# Altium schematic sheet BigBed.SchDoc
size A
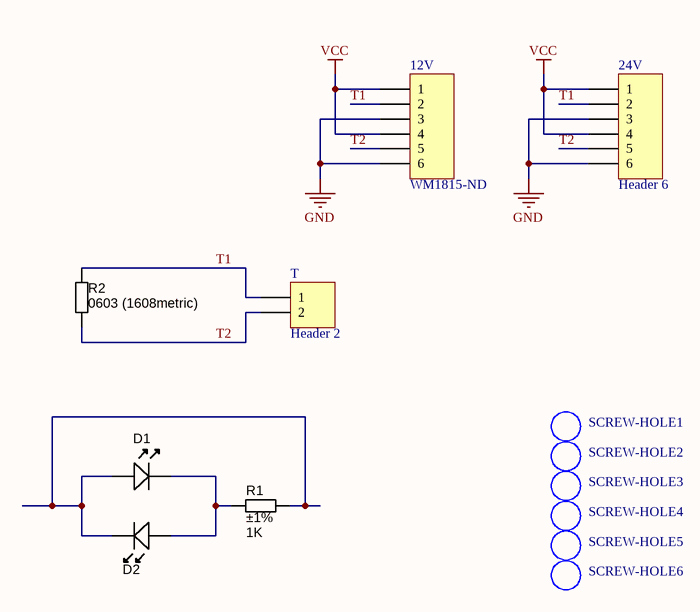
[diagram p0: BigBed.SchDoc]

## Parts
12V  WM1815-ND  [Molex Micro-Fit 6]
24V  Header 6  [Molex Micro-Fit 6]
D1  (no value)  [LED-0805-K]
D2  (no value)  [LED-0805-K]
R1  value 1K  Tolerance: ±1%  [RESC2012X70N]  (hidden comment: Thick Film)
R2  Package / Case: 0603 (1608metric)  [RESC1608X55N]  (hidden comment: RES_EMPTY_0603)
SCREW-HOLE1  Screw Hole  [M3-Hole-2]  (value not drawn)
SCREW-HOLE2  Screw Hole  [M3-Hole-2]  (value not drawn)
SCREW-HOLE3  Screw Hole  [M3-Hole-2]  (value not drawn)
SCREW-HOLE4  Screw Hole  [M3-Hole-2]  (value not drawn)
SCREW-HOLE5  Screw Hole  [M3-Hole-2]  (value not drawn)
SCREW-HOLE6  Screw Hole  [M3-Hole-2]  (value not drawn)
T  Header 2  [HDR1X2]

## Nets
GND: 12V.3 12V.6 24V.3 24V.6
VCC: 12V.1 12V.4 24V.1 24V.4
T1: 12V.2 24V.2 R2.1 T.1
T2: 12V.5 24V.5 R2.2 T.2
NetD1_A: D1.A D2.K R1.2
NetD1_K: D1.K D2.A R1.1

## Library data of the parts
12V 24V = Header 6: Header, 6-Pin; LatestRevisionDate: 17-Jul-2002; LatestRevisionNote: Re-released for DXP Platform.; Publisher: Altium Limited
D1 D2 = LED_SMD_Red_0805_6mcd: LED 0805 SMD Red 6mcd 621nm; Manufacturer 1: Lite-On Inc; Manufacturer Part Number 1: LTST-C171EKT; Material: GaAsP on GaP; Ratings: 6 mcd; 621 nm; SCDType: source; Package / Case: 0805; Supplier 1: Digi-Key; Supplier Part Number 1: 160-1422-1-ND; Value: Red; Color: Red
R1 = RES_1K_0805_1%: Resistor SMD chip 1k Ohm 0.125W 1% 0805; Manufacturer 1: Vishay/Dale; Manufacturer Part Number 1: CRCW08051K00FKEA; Ratings: 1/8W; SCDType: spec; Supplier 1: Digi-Key; Supplier Part Number 1: 541-1.00KCCT-ND; Package / Case: 0805 (2012 metric)
R2 = RES_EMPTY_0603: Resistor, 08603 SMD, Empty footprint; Value: N/A
T = Header 2: Header, 2-Pin; LatestRevisionDate: 17-Jul-2002; LatestRevisionNote: Re-released for DXP Platform.; Publisher: Altium Limited